# Altium project CONNECT-F22-WirelessMicroClimate.PrjPcb
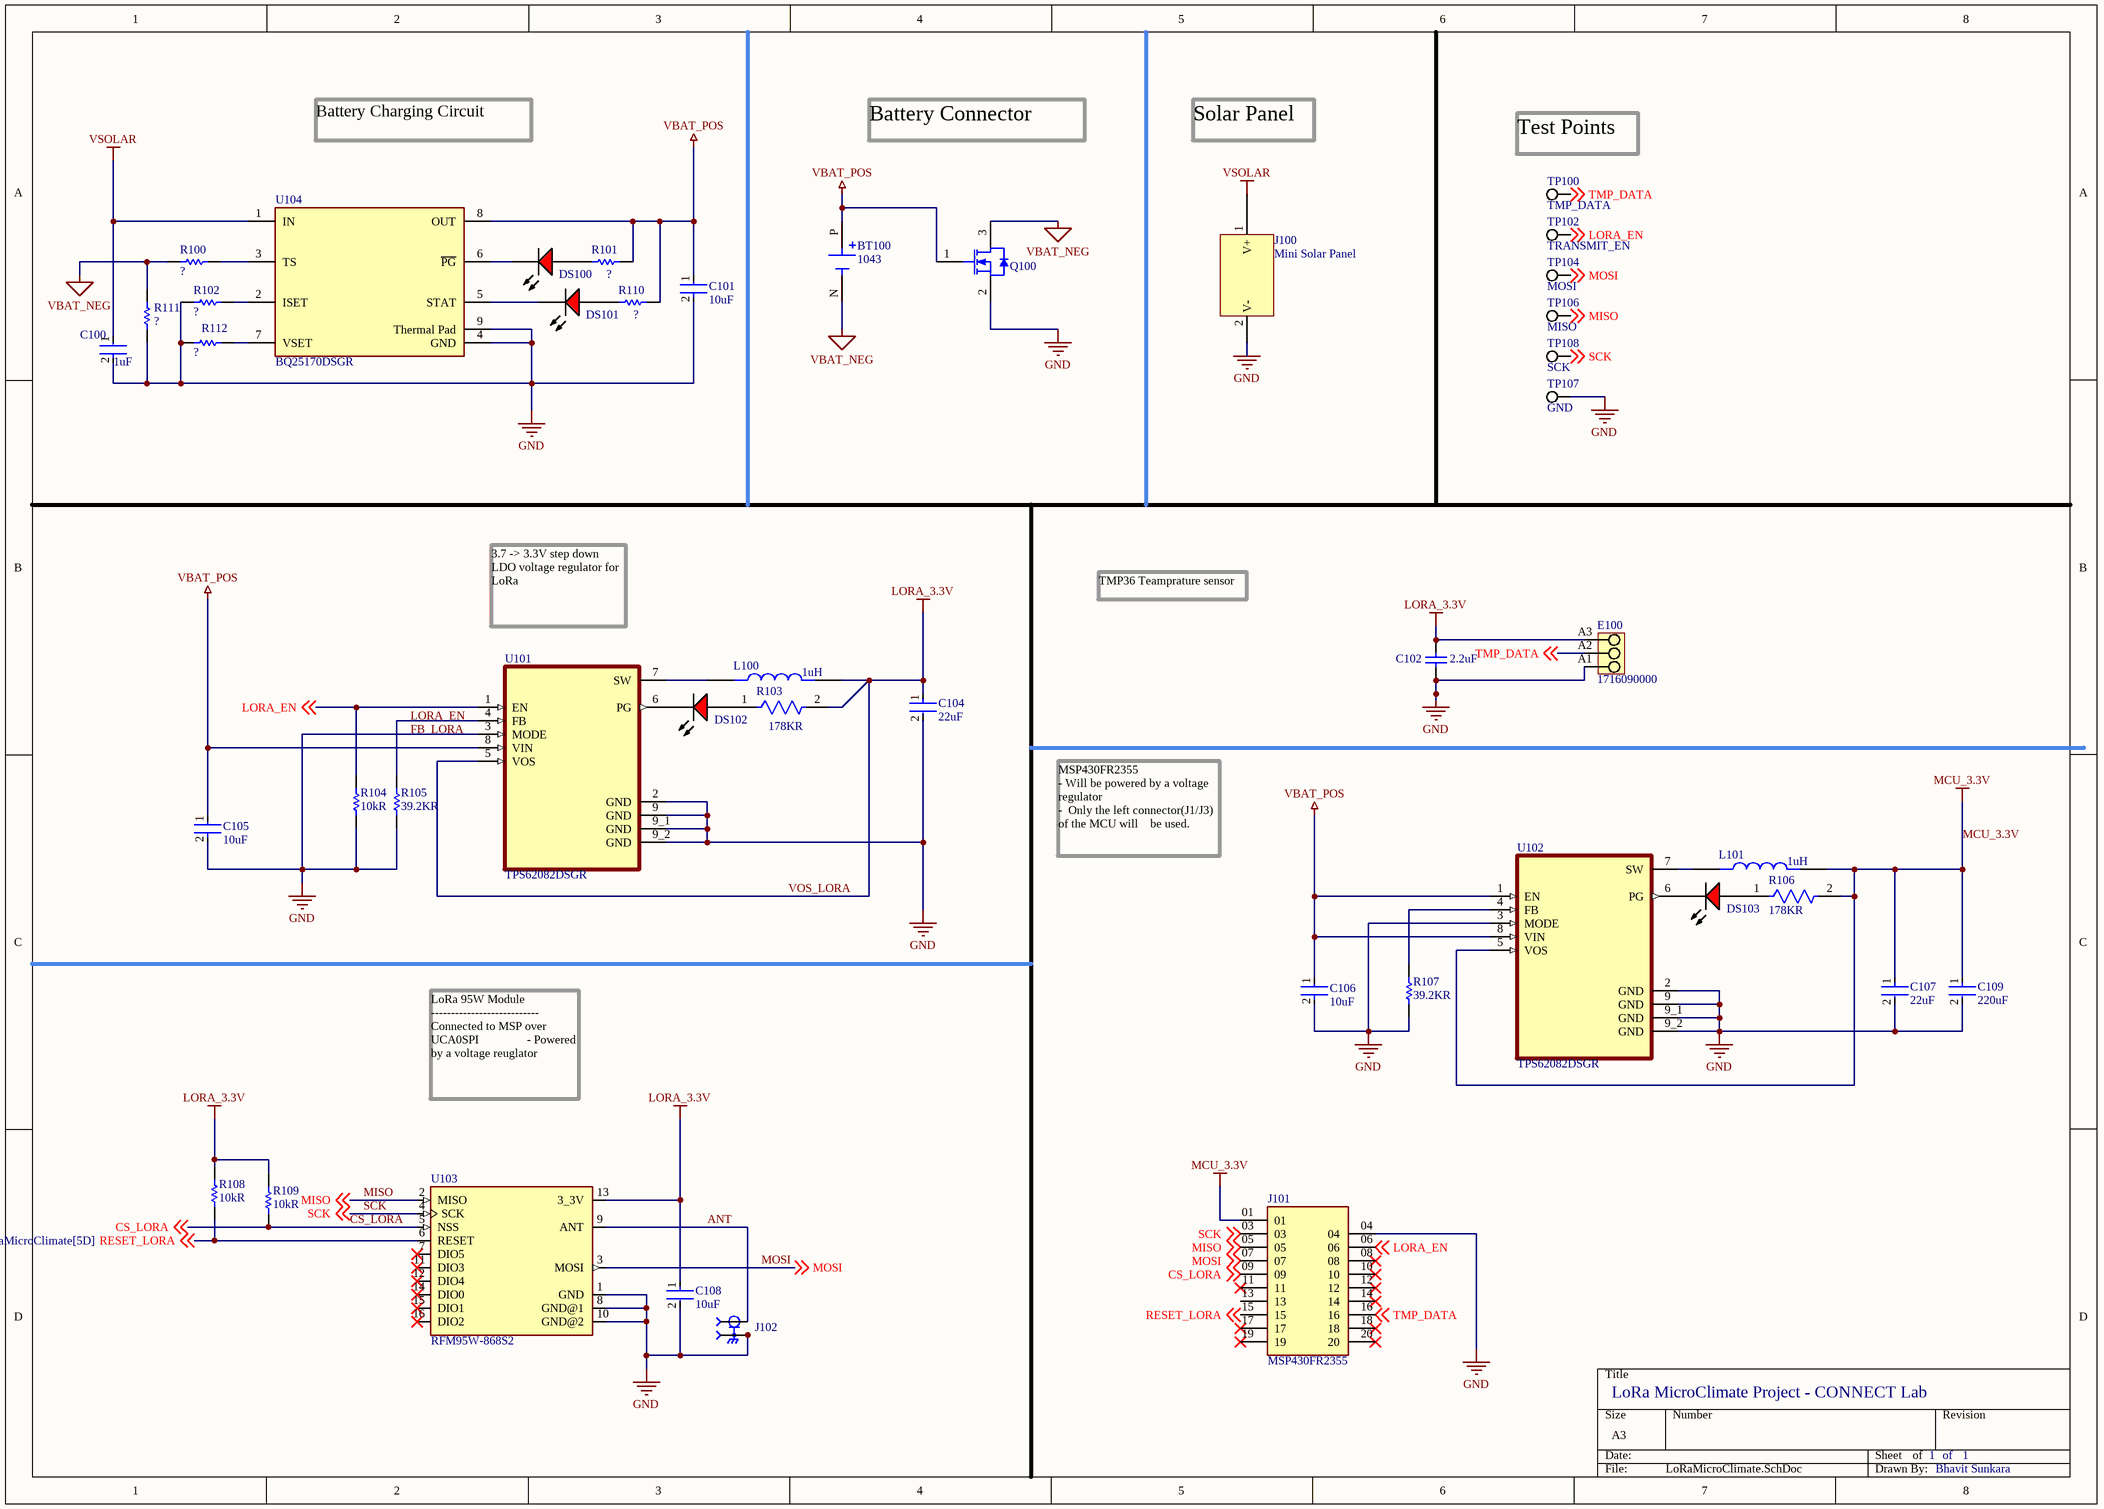
[diagram p0: LoRaMicroClimate.SchDoc]
1 sheet, 44 parts. Net scope: global (net labels, ports and power ports of the same name join across sheets).
Board file: LoRaMicroClimate.PcbDoc

## Sheet LoRaMicroClimate.SchDoc
size A3; SheetNumber: 1; SheetTotal: 1

### Parts
BT100  1043  [BAT_1043]
C100  1uF  [FP-C1608-080-0_1-MFG]
C101  10uF  [FP-C1608-080-0_1-MFG]
C102  2.2uF  [CAPC2113X120X50ML20T30]
C104  22uF  [FP-GRM21B-0_15-MFG]
C105  10uF  [FP-C1608-080-0_1-MFG]
C106  10uF  [FP-C1608-080-0_1-MFG]
C107  22uF  [FP-GRM21B-0_15-MFG]
C108  10uF  [FP-CL05A106MP5NUNC-MFG]
C109  220uF  [FP-GRM21B-0_15-MFG]
DS100  HSMS-C190  [AVAG-HSMX-C190_V]  (value not drawn)
DS101  HSMS-C190  [AVAG-HSMX-C190_V]  (value not drawn)
DS102  HSMS-C190  [AVAG-HSMX-C190_V]  (value not drawn)
DS103  HSMS-C190  [AVAG-HSMX-C190_V]  (value not drawn)
E100  1716090000  [LM_5_08_90_03]
J100  Mini Solar Panel  [P122]
J101  MSP430FR2355  [SAMTEC_TSW-110-07-G-D-002]
J102  SMA-J-P-X-ST-TH1  [SAMTEC_SMA-J-P-X-ST-TH1]  (value not drawn)
L100  1uH  [IND_ASPI-3012S-1R0M-T]
L101  1uH  [IND_ASPI-3012S-1R0M-T]
Q100  2N7002-T1-E3  [VISH-TO-236-3_A_L]  (value not drawn)
R100  ?  [RESC1005X40X25LL05T10]
R101  ?  [RESC1005X40X25LL05T10]
R102  ?  [RESC1005X40X25LL05T10]
R103  178KR  [FP-CRCW0603-e3-IPC_A]
R104  10kR  [RESC1005X40X25LL05T10]
R105  39.2KR  [RESC1609X50X30LL10T20]
R106  178KR  [FP-CRCW0603-e3-IPC_A]
R107  39.2KR  [RESC1609X50X30LL10T20]
R108  10kR  [RESC1005X40X25LL05T10]
R109  10kR  [RESC1005X40X25LL05T10]
R110  ?  [RESC1005X40X25LL05T10]
R111  ?  [RESC1005X40X25LL05T10]
R112  ?  [RESC1005X40X25LL05T10]
TP100  TMP_DATA  [KSTN-5019_V]
TP102  TRANSMIT_EN  [KSTN-5019_V]
TP104  MOSI  [KSTN-5019_V]
TP106  MISO  [KSTN-5019_V]
TP107  GND  [KSTN-5019_V]
TP108  SCK  [KSTN-5019_V]
U101  TPS62082DSGR  [SON50P200X200X80-9N]
U102  TPS62082DSGR  [SON50P200X200X80-9N]
U103  RFM95W-868S2  [XCVR_RFM95W-868S2]
U104  BQ25170DSGR  [FP-DSG0008A-IPC_A]

### Nets
GND: C100.2 C101.2 C102.1 C104.2 C105.2 C106.2 C107.2 C108.2 C109.2 E100.A1 J100.2(V-) J101.04 J102.2 J102.3 J102.4 J102.5 Q100.2(S) R102.1 R104.2 R105.2 R107.2 R111.1 R112.1 TP107.1 U101.2(GND) U101.3(MODE) U101.9(GND) U101.9_1(GND) U101.9_2(GND) U102.2(GND) U102.3(MODE) U102.9(GND) U102.9_1(GND) U102.9_2(GND) U103.1(GND) U103.8(GND@1) U103.10(GND@2) U104.4(GND) U104.9(Thermal_Pad)
MCU_3.3V: C107.1 C109.1 J101.01 L101.2 R106.2 U102.5(VOS)
VBAT_NEG: BT100.N Q100.3(D) R100.2 R111.2
VBAT_POS: BT100.P C101.1 C105.1 C106.1 Q100.1(G) R101.2 R110.2 U101.8(VIN) U102.1(EN) U102.8(VIN) U104.8(OUT)
VOS_LORA: C102.2 C104.1 C108.1 E100.A3 L100.2 R103.2 R108.2 R109.2 U101.5(VOS) U103.13(3_3V)  [also labelled LORA_3.3V]
VSOLAR: C100.1 J100.1(V+) U104.1(IN)
ANT: J102.1 U103.9(ANT)
~{CS}_LORA: J101.09 R109.1 U103.5(NSS) ; off-sheet CS_LORA  [also labelled CS_LORA]
FB_LORA: R105.1 U101.4(FB)
LORA_EN: J101.06 R104.1 TP102.1 U101.1(EN) ; off-sheet LORA_EN
MISO: J101.05 TP106.1 U103.2(MISO) ; off-sheet MISO
MOSI: J101.07 TP104.1 U103.3(MOSI) ; off-sheet MOSI
RESET_LORA: J101.15 R108.1 U103.6(RESET) ; off-sheet RESET_LORA
SCK: J101.03 TP108.1 U103.4(SCK) ; off-sheet SCK
TMP_DATA: E100.A2 J101.16 TP100.1 ; off-sheet TMP_DATA
NetDS100_1: DS100.1(A) R101.1
NetDS100_2: DS100.2(K) U104.6(~{PG})
NetDS101_1: DS101.1(A) R110.1
NetDS101_2: DS101.2(K) U104.5(STAT)
NetDS102_1: DS102.1(A) R103.1
NetDS102_2: DS102.2(K) U101.6(PG)
NetDS103_1: DS103.1(A) R106.1
NetDS103_2: DS103.2(K) U102.6(PG)
NetL100_1: L100.1 U101.7(SW)
NetL101_1: L101.1 U102.7(SW)
NetR100_1: R100.1 U104.3(TS)
NetR102_2: R102.2 U104.2(ISET)
NetR107_1: R107.1 U102.4(FB)
NetR112_2: R112.2 U104.7(VSET)

Not connected (* = marked no-connect by the designer): J101 08* 10* 11* 12* 13 14* 17* 18* 19* 20*; U103 7(DIO5)* 11(DIO3)* 12(DIO4)* 14(DIO0)* 15(DIO1)* 16(DIO2)*

### Notes on the sheet
- Battery Charging Circuit
- Battery Connector
- Solar Panel
- (near TP100) Test Points
- 3.7 -> 3.3V step down LDO voltage regulator for LoRa
- TMP36 Teamprature sensor
- MSP430FR2355
  - Will be powered by a voltage regulator
  -  Only the left connector(J1/J3) of the MCU will    be used.
- LoRa 95W Module --------------------------- Connected to MSP over UCA0SPI                - Powered by a voltage reuglator
- LoRa MicroClimate Project - CONNECT Lab
- 1
- of
- Bhavit Sunkara

### Library data of the parts
BT100 = 1043: Battery Holder (Open) 18650 1 Cell PC Pin; Package: None; Availability: Unavailable; Value: *; MP: 1043; Price: None
C100 = CMP-2000-04979-3: Multilayer Ceramic Capacitors 10μF ±10% 10V X5R SMD 0603; Capacitance: 10uF; Dielectric Material: Ceramic; Construction: Flat; Height: 0.8mm; Thickness: 0.035inch; Case Code (Metric): 1608; Radiation Hardening: No; Number of Pins: 2; Voltage Rating (DC): 10V; Depth: 0.8mm; Voltage: 10V; RoHS Compliant: Yes; Voltage Rating: 10V; Package Quantity: 1; Resistor Type: Ceramic; Termination: SMD/SMT; Lead Free: Lead Free; REACH SVHC: No SVHC; Tolerance: 10%; Mount: Surface Mount; Series: C; Packaging: Tape and Reel; Width: 0.8mm; Dielectric: X5R; Weight: 7.1E-05oz; Length: 1.6mm; Max Operating Temperature: 85°C; Case Code (Imperial): 0603; Case/Package: 0603; Min Operating Temperature: -55°C
C101 C105 C106 = CMP-2000-04979-3: Multilayer Ceramic Capacitors 10μF ±10% 10V X5R SMD 0603; Dielectric Material: Ceramic; Construction: Flat; Height: 0.8mm; Thickness: 0.035inch; Case Code (Metric): 1608; Radiation Hardening: No; Number of Pins: 2; Voltage Rating (DC): 10V; Depth: 0.8mm; Voltage: 10V; RoHS Compliant: Yes; Voltage Rating: 10V; Package Quantity: 1; Resistor Type: Ceramic; Termination: SMD/SMT; Lead Free: Lead Free; REACH SVHC: No SVHC; Tolerance: 10%; Mount: Surface Mount; Series: C; Packaging: Tape and Reel; Width: 0.8mm; Dielectric: X5R; Weight: 7.1E-05oz; Length: 1.6mm; Max Operating Temperature: 85°C; Case Code (Imperial): 0603; Case/Package: 0603; Min Operating Temperature: -55°C; Capacitance: 10uF
C102 = CMP-2007-04039-1: Part Number: TAJR225M010RNJ; Manufacturer: AVX Interconnect / Elco
C104 C107 C109 = CMP-2007-03385-2: Chip Multilayer Ceramic Capacitors for General Purpose, 0805, 22uF, X5R, 15%, 20%, 6.3V; Material: Ceramic; Max Operating Temperature: 85°C; Voltage: 6.3V; Min Operating Temperature: -55°C; Case/Package: 0805; Thickness: 0.053inch; Dielectric: X5R; Packaging: Tape and Reel; Depth: 1.25mm; Termination: SMD/SMT; Voltage Rating (DC): 6.3V; Radiation Hardening: No; Tolerance: 20%; Mount: Surface Mount; Lead Free: Lead Free; Package Quantity: 1; REACH SVHC: No SVHC; Voltage Rating: 6.3V; Capacitance: 22uF; Length: 2mm; Case Code (Imperial): 0805; Case Code (Metric): 2012; Width: 0.049inch; Height: 1.25mm
C108 = CMP-13271-000002-1: CAP CER 10UF 10V X5R 0402; Manufacturer Part Number: CL05A106MP5NUNC; Manufacturer: Samsung; Temperature Coefficient: 15%; Tolerance: 20%; Material: Ceramic; Octopart: https://octopart.com/cl05a106mp5nunc-samsung-22457395; Voltage Rating: 10V; RoHS: TRUE; Value: 10uF; Height: 0.7mm; Digikey Description: CAP CER 10UF 10V X5R 0402; Automotive: No; Package: CL05A106MP5NUNC; Device Class L1: Passive Components; Capacitance: 10uF; Temperature Range High: +85°C; ComponentLink2Description: Datasheet; Device Class L2: Capacitors; Temperature Characteristic: X5R; Temperature: -55°C to +85°C; ComponentLink2URL: http://www.samsungsem.com/kr/support/product-search/mlcc/__icsFiles/afieldfile/2019/05/10/19-CL05A106MP5NUNC.pdf; Device Class L3: Ceramic Capacitors; Category: Cap; Temperature Range Low: -55°C; Ipc Land Pattern Name: CAPC10050X50; Lead Free: Yes
DS100-DS103 = CMP-2000-06427-1: LED Uni-Color Red, 52 mW, 20 mA, -40 to 85 degC, 2-Pin SMD, RoHS, Tape and Reel; Manufacturer: Avago; Reverse Voltage: 5V; Viewing Angle: 170deg; High Brightness: No; Lens Type: ColorlessDiffused; DELETED: Compliant; Product Height (mm): 0.8mm; Dominant Wave Length: 626nm; Number of  Elements: 1; Chip Material: GaP; Lum Intensity: 10mcd; Product Length (mm): 1.6mm; Forward Voltage: 2.6V; Power Dissipation: 52W; Shape Type: Rectangular; Forward Current: 25mA; Peak Wavelength: 630nm; Test Current (It): 20mA; Main Category: ChipLED; Lens Dimensions: 1x0.8x0.5mm; Pin Count: 2; Package Reference: HSMX-C190; Mounting Technology: SurfaceMount; Mounting: SurfaceMount; Datasheet URL: http://docs.avagotech.com/docs/AV02-0551EN; Package Type: ChipLed; Operating Temperature Classification: Industrial; Datasheet Version: 03/2012; Operating Temp Range: -40Cto85C; Emitting Color: Red; Rad Hardened: No; Manufacturer URL: http://www.avagotech.com/; Luminous Intensity: 10mcd; Package Description: 2-Pin Surface Mount Device, Body 1.6 x 0.8 mm, Height 0.9 mm; Type: Uni-Color; Packaging: TapeandReel; Product Depth (mm): 0.8mm
E100 = CMP-1559-01768-1: OMNIMATE Signal - series LM; Manufacturer: Weidmueller; Contact_surface: tinned; Pitch_mm: 5,08 mm; Solder_pin_length_mm: 3,5 mm; Contact_material: Cu-Leg; Wire_cross_section_AWG_min_UL_1059: AWG 24; Solid_min_H05_07_V_U: 0,2 mm²; Insulating_material: Wemid (PA); Solid_max_H05_07_V_U: 2,5 mm²; Pitch_inch: 0,2 inch; Wire_cross_section_AWG_max_UL_1059: AWG 14; UL_94_flammability_rating: V-0; No_of_poles: 3; Rated_voltage_use_group_B_UL_1059: 300 V; Mounting_onto_the_PCB: Solder connection; Side_termination_characteristic: closed side; Short_text_for_material: LM 5.08/03/90 3.5SN OR BX; Rated_current_use_group_B_UL_1059: 15 A; Rated_voltage_for_surge_voltage_class_pollution_degree_II_2: 630 V; Revision: V1; ComponentLink2URL: http://catalog.weidmueller.com/catalog/Start.do?localeId=en&ObjectID=1716090000; Colour: Orange; PackageReference: LM_5_08_90_03; ComponentLink1Description: Manufacturer URL; ComponentLink2Description: URL Link1; ComponentLink1URL: http://www.weidmueller.com/; Qty: 500 PCS; PartNumber: 1716090000; Packaging: Box
J100 = P122: The 0.3 Watt 6 Volt mini solar panel is designed for 5-7 year outdoor applications. It will charge a 1S LiIon or LiFePO4 cell. The panel
J101 = TSW-110-07-G-D-002: Availability: Unavailable; Value: *; Price: None; MP: TSW-110-07-G-D-002; Package: None
J102 = SMA-J-P-X-ST-TH1: SMA STRAIGHT, THROUGH HOLE JACK- 50 OHM; Package: None; Price: None; Availability: Unavailable; MP: SMA-J-P-X-ST-TH1; Value: *
L100 L101 = ASPI-3012S-1R0M-T: Inductor Power Shielded Wirewound 1uH 20% 100KHz 2.2A 0.04Ohm DCR 1212 T/R; MF: Abracon Corporation; SnapEDA_Link: https://www.snapeda.com/parts/ASPI-3012S-1R0M-T/Abracon/view-part/?ref=snap; Availability: In Stock; Price: None; Purchase-URL: https://pricing.snapeda.com/search/part/ASPI-3012S-1R0M-T/?ref=eda; Check_prices: https://www.snapeda.com/parts/ASPI-3012S-1R0M-T/Abracon/view-part/?ref=eda; Package: None; MP: ASPI-3012S-1R0M-T; Value: *
Q100 = CMP-2000-05565-1: N-Channel MOSFET, 115 mA, 60 V, -55 to 150 degC, 3-Pin SOT23, RoHS, Tape and Reel; Manufacturer: Vishay; Continuous Drain Current Id: 115mA; Threshold Voltage Vgs: 2.1V; Transistor Case Style: TO-236; On Resistance Rds(on): 7.5ohm; Transistor Polarity: NChannel; Power Dissipation Pd: 200mW; No. of Pins: 3; SVHC: NoSVHC(17-Dec-2014); Drain Source Voltage Vds: 60V; Rds(on) Test Voltage Vgs: 10V; Package URL: http://www.vishay.com/docs/71196/71196.pdf; Package Description: 3-Pin Small Outline Transistor, Body 2.92 x 1.3 mm, Pitch 0.95 mm; Datasheet URL: http://www.vishay.com/docs/70226/70226.pdf; Package Reference: TO-236-3; MSL: MSL1-Unlimited; Mounting Technology: SurfaceMount; Operating Temperature Max: 150°C; Datasheet Version: Rev. F, 07/2001; Manufacturer URL: http://www.vishay.com/
R100-R102 R104 R108-R112 = CMP-2002-07353-1: Part Number: RC0402FR-0710KL; Manufacturer: Yageo / Phycomp
R103 R106 = CMP-2000-02945-2: RES Thick Film, 178kΩ, 1%, 0.1W, 100ppm/°C, 0603; Voltage Rating: 75V; Max Power Dissipation: 100mW; Contact Plating: Tin; Radiation Hardening: No; Lead Free: Lead Free; Military Standard: Not; Resistance: 178kR; Termination: SMD/SMT; Tolerance: 1%; Length: 1.55mm; Max Operating Temperature: 155°C; Case/Package: 0603; Case Code (Metric): 1608; Composition: Thick Film; Weight: 7.1E-05oz; Min Operating Temperature: -55°C; Power Rating: 100mW; Case Code (Imperial): 0603; Number of Pins: 2; Temperature Coefficient: 100ppm/°C; Features: Automotive AEC-Q200; Width: 0.033inch; Number of Terminations: 2; Packaging: Tape and Reel; Height: 0.45mm; Depth: 0.85mm; Voltage Rating (DC): 75V; Package Quantity: 10
R105 R107 = CMP-2000-03290-1: Manufacturer: Vishay Dale; Part Number: CRCW060339K2FKEA
TP100 TP102 TP104 TP106-TP108 = CMP-1672-00008-1: Test Point, 1 Position SMD, RoHS, Tape and Reel; ComponentLink1Description: Manufacturer URL; Package Quantity: 1000; DatasheetVersion: 03/2014; Packaging: Tape and Reel; ComponentLink2URL: http://www.keyelco.com/product-pdf.cfm?p=1357; ComponentLink1URL: http://www.keyelco.com/; Mount: Surface Mount; Contact Plating: Silver; PackageDescription: 1-Pin Surface Mount Device, Body 3.81 x 2.03 mm; Pins: 1; RoHSCompliant: True; Mounting Technology: Surface Mount; ComponentLink2Description: Datasheet; PackageReference: 5019
U101 U102 = TPS62082DSGR: 1.2A High Efficient Step Down Converter in 2x2mm SON Package. 3.3 Vout (Min) 8-WSON -40 to 125; MF: Texas Instruments; SnapEDA_Link: https://www.snapeda.com/parts/TPS62082DSGR/Texas%20Instruments/view-part/232318/?ref=snap; Digi-Key_Part_Number: 296-49331-1-ND; Purchase-URL: https://pricing.snapeda.com/search/part/TPS62082DSGR/?ref=eda; Value: *; MP: TPS62082DSGR; Package: WSON-8 Texas Instruments; Check_prices: https://www.snapeda.com/parts/TPS62082DSGR/Texas%20Instruments/view-part/232318/?ref=eda
U103 = RFM95W-868S2: Mod Txrx Lora +20dbm 868mhz Smd; Value: *; MP: RFM95W-868S2; Availability: Unavailable; Package: None; Price: None
U104 = CMP-04911-000084-1: 800-MA LINEAR BATTERY CHARGER FO